# EAGLE design esp32-esp32s3_adapter_for_2.0 (EAGLE 9.6.2)
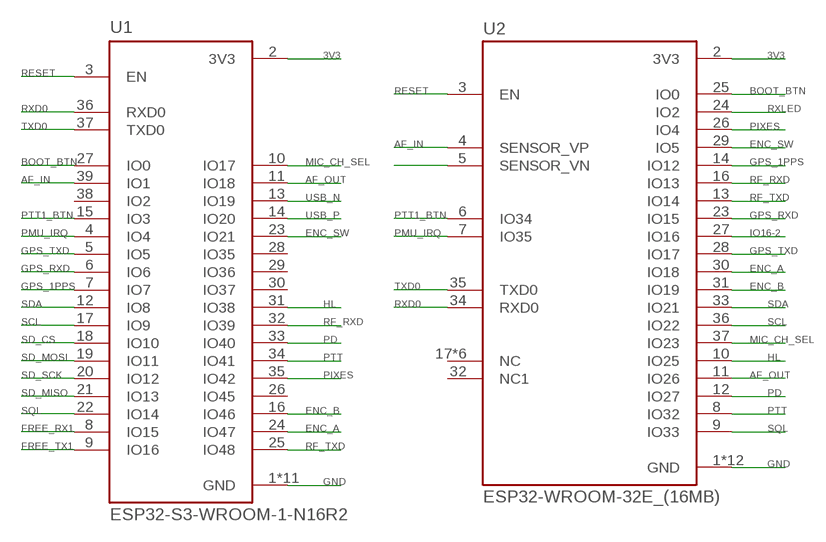
[diagram p0: schematic, sheet 1]

## Parts
U1  ESP32-S3-WROOM-1-N16R2  [XCVR_ESP32-S3-WROOM-1-N16R2]
U2  ESP32-WROOM-32E_(16MB)  [XCVR_ESP32-WROOM-32E_(16MB)]

## Nets
3V3: U1.2(3V3) U2.2(3V3)
AF_IN: U1.39(IO1) U2.4(SENSOR_VP)
AF_OUT: U1.11(IO18) U2.11(IO26)
BOOT_BTN: U1.27(IO0) U2.25(IO0)
ENC_A: U1.24(IO47) U2.30(IO18)
ENC_B: U1.16(IO46) U2.31(IO19)
ENC_SW: U1.23(IO21) U2.29(IO5)
FREE_RX1: U1.8(IO15)
FREE_TX1: U1.9(IO16)
GND: U1.1(GND) U1.40(GND) U1.41_1(GND) U1.41_2(GND) U1.41_3(GND) U1.41_4(GND) U1.41_5(GND) U1.41_6(GND) U1.41_7(GND) U1.41_8(GND) U1.41_9(GND) U2.1(GND) U2.15(GND) U2.38(GND) U2.39_1(GND) U2.39_2(GND) U2.39_3(GND) U2.39_4(GND) U2.39_5(GND) U2.39_6(GND) U2.39_7(GND) U2.39_8(GND) U2.39_9(GND)
GPS_1PPS: U1.7(IO7) U2.14(IO12)
GPS_RXD: U1.6(IO6) U2.23(IO15)
GPS_TXD: U1.5(IO5) U2.28(IO17)
HL: U1.31(IO38) U2.10(IO25)
IO16-2: U2.27(IO16)
MIC_CH_SEL: U1.10(IO17) U2.37(IO23)
N$42: U2.5(SENSOR_VN)
PD: U1.33(IO40) U2.12(IO27)
PIXES: U1.35(IO42) U2.26(IO4)
PMU_IRQ: U1.4(IO4) U2.7(IO35)
PTT: U1.34(IO41) U2.8(IO32)
PTT1_BTN: U1.15(IO3) U2.6(IO34)
RESET: U1.3(EN) U2.3(EN)
RF_RXD: U1.32(IO39) U2.16(IO13)
RF_TXD: U1.25(IO48) U2.13(IO14)
RXD0: U1.36(RXD0) U2.34(RXD0)
RXLED: U2.24(IO2)
SCL: U1.17(IO9) U2.36(IO22)
SD_CS: U1.18(IO10)
SD_MISO: U1.21(IO13)
SD_MOSI: U1.19(IO11)
SD_SCK: U1.20(IO12)
SDA: U1.12(IO8) U2.33(IO21)
SQL: U1.22(IO14) U2.9(IO33)
TXD0: U1.37(TXD0) U2.35(TXD0)
USB_N: U1.13(IO19)
USB_P: U1.14(IO20)
Unconnected: U1.26(IO45) U1.28(IO35) U1.29(IO36) U1.30(IO37) U1.38(IO2) U2.17(NC) U2.18(NC) U2.19(NC) U2.20(NC) U2.21(NC) U2.22(NC) U2.32(NC1)

## Library data of the parts
U1 = ESP32-S3-WROOM-1-N16R2:ESP32-S3-WROOM-1-N16R2: Check availability <https://pricing.snapeda.com/parts/ESP32-S3-WROOM-1-N16R2/Espressif%20Systems/view-part?ref=eda>; AVAILABILITY: In Stock; DESCRIPTION: Bluetooth, WiFi 802.11b/g/n, Bluetooth v5.0 Transceiver Module 2.4GHz PCB Trace Surface Mount; MF: Espressif Systems; MP: ESP32-S3-WROOM-1-N16R2; PACKAGE: None; PRICE: None; PURCHASE-URL: https://pricing.snapeda.com/search?q=ESP32-S3-WROOM-1-N16R2&ref=eda
U2 = ESP32-WROOM-32E__16MB_:ESP32-WROOM-32E_(16MB): Check availability <https://pricing.snapeda.com/parts/ESP32-WROOM-32E%20%2816MB%29/Espressif%20Systems/view-part?ref=eda>; AVAILABILITY: Not in stock; DESCRIPTION: Bluetooth, WiFi 802.11b/g/n, Bluetooth v4.2 +EDR, Class 1, 2 and 3 Transceiver Module 2.4GHz ~ 2.5GHz Integrated, Trace Surface Mount; MF: Espressif Systems; MP: ESP32-WROOM-32E (16MB); PACKAGE: SMD-44 Espressif Systems; PRICE: None

## Board
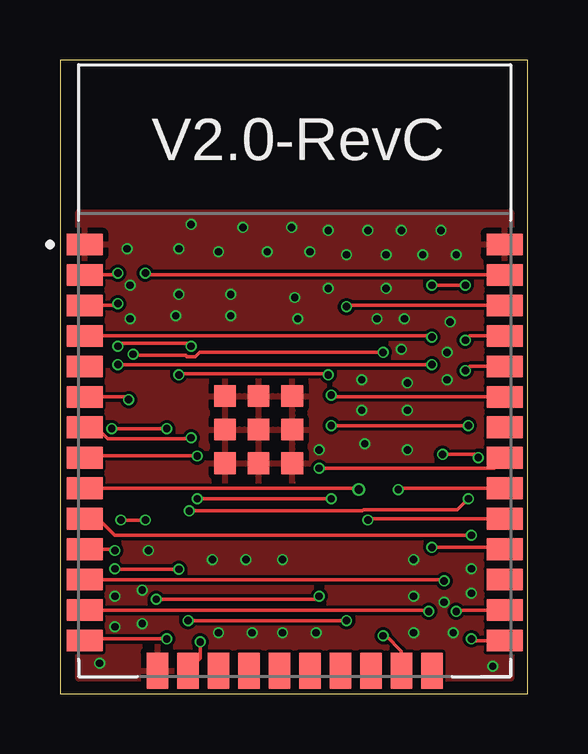
[diagram p1: board, top side]
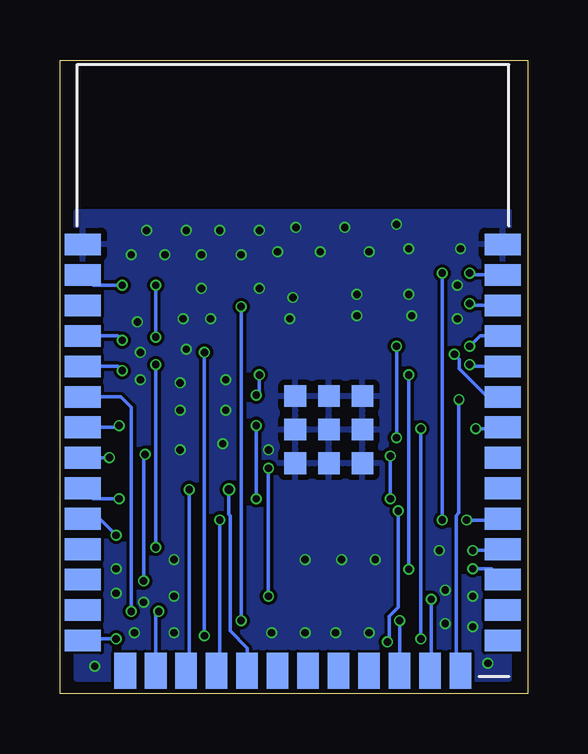
[diagram p2: board, bottom side, seen from below]

Size 19.48 x 26.41 mm. Coordinates in mm from the lower left corner, seen from the top.
Outline: 0,0 19.48,0 19.48,26.41 0,26.41 0,0
Copper layers (1*16): Top 0.035559375mm / dielectric 1.6mm / Bottom 0.035559375mm
Design rules "jlcpcb-2layers *": minimum track width 5mil, minimum drill 12mil, track to track 5mil, track to pad 5mil, pad to pad 5mil, via to via 5mil, smd to smd 5mil, copper to edge 8mil, drill to drill 6mil, minimum pad ring 5mil, minimum via ring 3mil, stop-mask expansion 2.5mil, vias tented up to drill 15mil, thermal gap 10mil

### Footprints (pad centres in the part's own frame; a part is rotated, then mirrored left to right if it is on the bottom)
XCVR_ESP32-S3-WROOM-1-N16R2 = smd 1.5 x 0.9 bottom: 1 -8.75,5.26; 2 -8.75,3.99; 3 -8.75,2.72; 4 -8.75,1.45; 5 -8.75,0.18; 6 -8.75,-1.09; 7 -8.75,-2.36; 8 -8.75,-3.63; 9 -8.75,-4.9; 10 -8.75,-6.17; 11 -8.75,-7.44; 12 -8.75,-8.71; 13 -8.75,-9.98; 14 -8.75,-11.25; 27 8.75,-11.25; 28 8.75,-9.98; 29 8.75,-8.71; 30 8.75,-7.44; 31 8.75,-6.17; 32 8.75,-4.9; 33 8.75,-3.63; 34 8.75,-2.36; 35 8.75,-1.09; 36 8.75,0.18; 37 8.75,1.45; 38 8.75,2.72; 39 8.75,3.99; 40 8.75,5.26 | smd 0.9 x 1.5 bottom: 15 -6.985,-12.5; 16 -5.715,-12.5; 17 -4.445,-12.5; 18 -3.175,-12.5; 19 -1.905,-12.5; 20 -0.635,-12.5; 21 0.635,-12.5; 22 1.905,-12.5; 23 3.175,-12.5; 24 4.445,-12.5; 25 5.715,-12.5; 26 6.985,-12.5 | smd 0.9 x 0.9 bottom: 41_1 -1.5,-2.46; 41_2 -2.9,-2.46; 41_3 -0.1,-2.46; 41_4 -2.9,-3.86; 41_5 -1.5,-3.86; 41_6 -0.1,-3.86; 41_7 -2.9,-1.06; 41_8 -1.5,-1.06; 41_9 -0.1,-1.06
XCVR_ESP32-WROOM-32E_(16MB) = smd 1.5 x 0.9: 1 -8.75,5.26; 2 -8.75,3.99; 3 -8.75,2.72; 4 -8.75,1.45; 5 -8.75,0.18; 6 -8.75,-1.09; 7 -8.75,-2.36; 8 -8.75,-3.63; 9 -8.75,-4.9; 10 -8.75,-6.17; 11 -8.75,-7.44; 12 -8.75,-8.71; 13 -8.75,-9.98; 14 -8.75,-11.25; 25 8.75,-11.25; 26 8.75,-9.98; 27 8.75,-8.71; 28 8.75,-7.44; 29 8.75,-6.17; 30 8.75,-4.9; 31 8.75,-3.63; 32 8.75,-2.36; 33 8.75,-1.09; 34 8.75,0.18; 35 8.75,1.45; 36 8.75,2.72; 37 8.75,3.99; 38 8.75,5.26 | smd 0.9 x 1.5: 15 -5.715,-12.5; 16 -4.445,-12.5; 17 -3.175,-12.5; 18 -1.905,-12.5; 19 -0.635,-12.5; 20 0.635,-12.5; 21 1.905,-12.5; 22 3.175,-12.5; 23 4.445,-12.5; 24 5.715,-12.5 | smd 0.9 x 0.9: 39_1 -2.9,-1.06; 39_2 -1.5,-1.06; 39_3 -0.1,-1.06; 39_4 -2.9,-2.46; 39_5 -1.5,-2.46; 39_6 -0.1,-2.46; 39_7 -2.9,-3.86; 39_8 -1.5,-3.86; 39_9 -0.1,-3.86

### Placement (x,y rotation side)
U1  9.78,13.46 0 top
U2  9.78,13.46 0 top

### Tracks (layer width: path | path; a pad name or v marks a point on that pad's centre or on a via)
3V3  (via drill 0.3)
  Top 0.152: v2.41,17.53 2.34,17.45 U2.2
  Bottom 0.152: U2.2 2.34,17.45 v2.41,17.53
AF_IN  (via drill 0.3)
  Top 0.152: U2.4 15.44,14.91 v15.49,14.86 | v15.49,17.02 v16.89,17.02
  Bottom 0.152: v15.49,14.86 v15.49,17.02 | v16.89,17.02 18.09,17.02 U1.39
AF_OUT  (via drill 0.3)
  Top 0.152: U1.11 2.23,6.02 v2.29,5.97
  Bottom 0.152: v2.29,5.97 1.08,5.97 U1.11
BOOT_BTN  (via drill 0.3)
  Top 0.152: U2.25 17.14,2.21 v17.14,2.29
  Bottom 0.152: v17.14,2.29 18.53,2.29 U2.25
ENC_A  (via drill 0.3)
  Top 0.152: U2.30 14.15,8.56 v14.1,8.51
  Bottom 0.152: v14.1,8.51 14.1,1.09 U1.24
ENC_B  (via drill 0.3)
  Top 0.152: U2.31 18.09,9.4 v10.79,9.4 | v10.79,4.06 10.67,3.94 8,3.94 v4.01,3.94
  Bottom 0.152: v10.79,9.4 v10.79,4.06 | v4.01,3.94 4.01,1.01 U1.16
ENC_SW  (via drill 0.3)
  Top 0.152: U2.29 12.88,7.29 v12.83,7.24
  Bottom 0.152: v12.83,7.24 12.83,1.09 U1.23
GND  (via drill 0.3)
  other vias: 10.79,10.16 6.35,5.59 7.75,5.59 9.27,5.59 6.6,2.54 8,2.54 9.27,2.54 10.67,2.54 17.14,4.19 16.38,2.54 16,3.81 14.73,5.59 14.73,4.06 14.73,2.54 17.14,5.21 14.48,10.16 14.48,11.81 14.48,12.95 12.57,13.08 12.57,11.81 12.7,10.41 16.13,13.08 16.13,14.22 14.22,14.35 16.26,15.49 13.21,15.62 14.35,15.62 9.91,15.62 7.11,15.75 4.83,15.75 4.95,16.64 7.11,16.64 9.78,16.51 13.59,16.89 11.18,16.89 2.92,17.02 2.92,15.62 2.79,18.54 4.95,18.54 6.6,18.41 8.64,18.41 10.41,18.41 11.94,18.29 13.59,18.29 15.11,18.29 16.51,18.29 15.88,19.3 14.22,19.3 12.83,19.3 11.18,19.3 9.65,19.43 7.62,19.43 5.46,19.56 3.68,5.97 2.29,4.06 2.29,2.79 1.65,1.27 18.03,1.14 3.43,4.32 3.43,2.92
  pour Top: 0.76,20.07 18.8,20.07 18.8,0.63 0.76,0.63
  pour Bottom: 0.76,20.07 18.8,20.07 18.8,0.63 0.76,0.63
GPS_1PPS  (via drill 0.3)
  Top 0.152: U2.14 1.1,2.29 v4.45,2.29 | v4.45,11.05 v2.16,11.05
  Bottom 0.152: v4.45,2.29 v4.45,11.05 | v2.16,11.05 1.08,11.05 U1.7
GPS_RXD  (via drill 0.3)
  Top 0.152: U2.23 14.22,1.78 13.59,2.41 v13.46,2.41 | v13.46,14.22 5.81,14.22 5.64,14.05 5.28,14.05 5.23,14.1 3.05,14.1 v3.05,14.15
  Bottom 0.152: v3.05,14.15 2.84,13.94 2.84,13.54 1.68,12.37 U1.6 | v13.46,2.41 v13.46,14.22
GPS_TXD  (via drill 0.3)
  Top 0.152: v2.41,13.72 v15.49,13.72 | v15.49,6.1 18.46,6.1 U2.28
  Bottom 0.152: U1.5 2.34,13.64 v2.41,13.72 | v15.49,13.72 v15.49,6.1
HL  (via drill 0.3)
  Top 0.152: U2.10 1.6,7.29 2.29,6.6 v17.14,6.6
  Bottom 0.152: v17.14,6.6 17.83,7.29 U1.31
MIC_CH_SEL  (via drill 0.3)
  Top 0.152: U2.37 3.63,17.45 v3.56,17.53 | v3.56,7.24 v2.54,7.24
  Bottom 0.152: v3.56,17.53 v3.56,7.24 | v2.54,7.24 1.08,7.24 U1.10
PD  (via drill 0.3)
  Top 0.152: U2.12 15.95,4.75 v16,4.7 | v15.94,9.97 17.46,9.97 17.53,9.91 17.46,9.84 v17.42,9.84
  Bottom 0.152: U1.33 18.46,9.91 18.39,9.84 v17.42,9.84 | v15.94,9.97 16,9.91 v16,4.7
PIXES  (via drill 0.3)
  Top 0.152: v16.51,3.43 16.56,3.48 U2.26
  Bottom 0.152: U1.35 16.94,12.37 16.51,11.94 v16.51,3.43
PMU_IRQ  (via drill 0.3)
  Top 0.152: U2.7 1.5,11.1 1.98,10.62 5.41,10.62 v5.46,10.67 | v5.46,14.48 5.34,14.6 2.41,14.6 v2.41,14.48
  Bottom 0.152: v5.46,10.67 v5.46,14.48 | v2.41,14.48 1.98,14.91 U1.4
PTT  (via drill 0.3)
  Top 0.152: v17.02,11.18 v11.3,11.18 | v11.3,8.13 v5.71,8.13 | v5.71,9.91 1.1,9.91 U2.8
  Bottom 0.152: U1.34 17.09,11.1 v17.02,11.18 | v11.3,11.18 v11.3,8.13 | v5.71,8.13 v5.71,9.91
PTT1_BTN  (via drill 0.3)
  Top 0.152: U2.6 2.87,12.37 2.92,12.32 v2.86,12.26
  Bottom 0.152: v2.86,12.26 2.86,7.53 2.97,7.42 2.97,1.14 U1.15
RESET  (via drill 0.3)
  Top 0.152: U1.3 2.34,16.18 v2.41,16.26
  Bottom 0.152: v2.41,16.26 2.34,16.18 U1.3
RF_RXD  (via drill 0.3)
  Top 0.152: v5.38,7.62 12.6,7.62 12.65,7.67 16.56,7.67 v17.02,8.13 | v5.84,2.16 5.84,1.47 U2.16
  Bottom 0.152: U1.32 18.09,8.13 v17.02,8.13 | v5.38,7.62 5.38,3.61 5.77,3.23 5.77,2.23 v5.84,2.16
RF_TXD  (via drill 0.3)
  Top 0.152: U2.13 15.31,3.48 v15.37,3.43
  Bottom 0.152: v15.37,3.43 15.49,3.3 U1.25
RXD0  (via drill 0.3)
  Top 0.152: U1.36 17.07,13.64 v16.89,13.46
  Bottom 0.152: v16.89,13.46 17.07,13.64 U1.36
SCL  (via drill 0.3)
  Top 0.152: U2.36 11.99,16.18 v11.94,16.13 | v11.94,3.05 v5.33,3.05
  Bottom 0.152: v11.94,16.13 v11.94,3.05 | v5.33,3.05 U1.17
SDA  (via drill 0.3)
  Top 0.152: U2.33 11.38,12.37 v11.3,12.45 | v11.18,13.28 11.12,13.33 5,13.33 v4.95,13.28 | v4.95,5.18 2.31,5.18 v2.29,5.21
  Bottom 0.152: v11.3,12.45 11.18,12.57 v11.18,13.28 | v4.95,13.28 v4.95,5.18 | v2.29,5.21 1.48,5.21 U1.12
SQL  (via drill 0.35)
  Top 0.152: U2.9 12.39,8.56 v12.45,8.51
  Bottom 0.152: v12.45,8.51 12.45,7.47 12.39,7.42 12.39,2.62 11.68,1.9 U1.22
TXD0  (via drill 0.3)
  Top 0.152: v16.89,14.73 17.07,14.91 U1.37
  Bottom 0.152: U1.37 17.07,14.91 v16.89,14.73

### Text on the board
tNames: V2.0-RevC